# EAGLE design Photo-Penumograph (EAGLE 8.2.0)
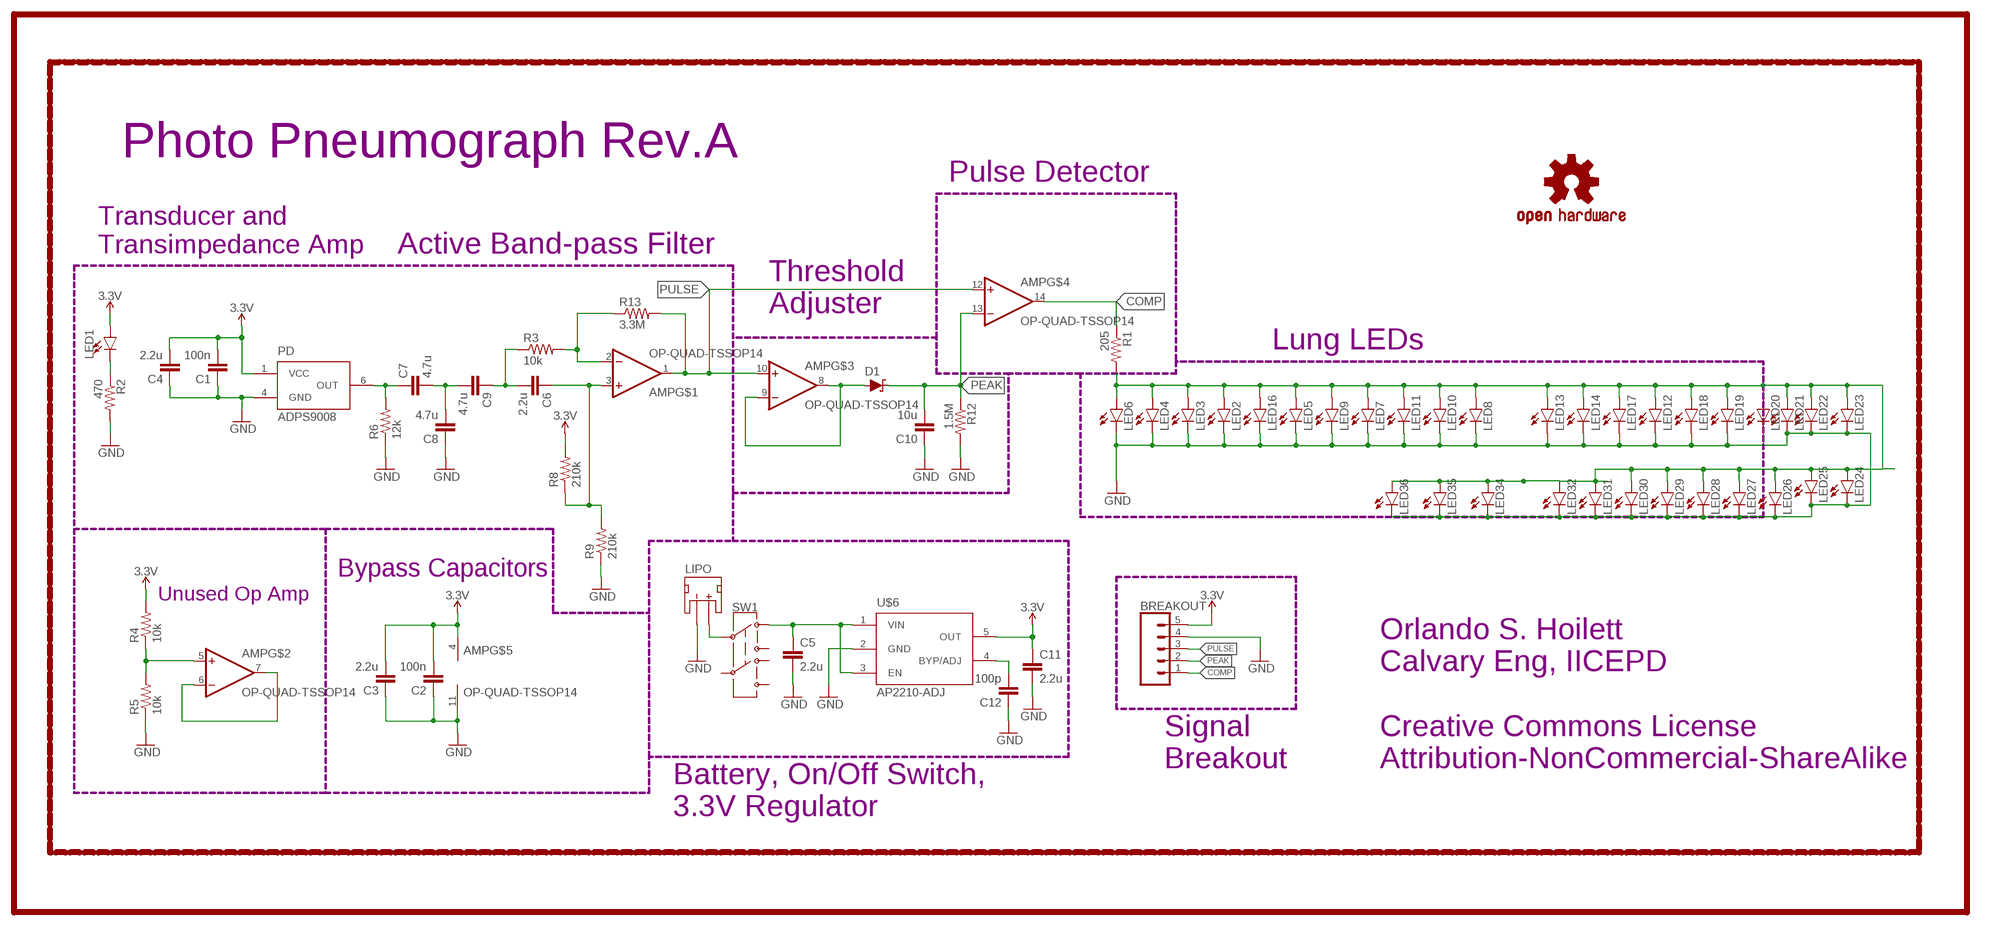
[diagram p0: schematic, sheet 1]

## Parts
AMP  OP-QUAD-TSSOP14  [TSSOP14]
BREAKOUT  CONN_05  [1X05]
C1  100n  CAPACITOR0402  [C0402]
C2  100n  CAPACITOR0402  [C0402]
C3  2.2u  CAPACITOR0603  [C0603]
C4  2.2u  CAPACITOR0603  [C0603]
C5  2.2u  CAPACITOR0603  [C0603]
C6  2.2u  CAPACITOR0603  [C0603]
C7  4.7u  CAPACITOR0603  [C0603]
C8  4.7u  CAPACITOR0603  [C0603]
C9  4.7u  CAPACITOR0603  [C0603]
C10  10u  CAPACITOR0805  [C0805]
C11  2.2u  CAPACITOR0603  [C0603]
C12  100p  CAPACITOR0402  [C0402]
D1  SCHOTTKY-SOD-123FL  [SOD123]
LED1  LEDZ-BEND  [2-SMD.Z-BEND]
LED2  LED5MM  [LED5MM]
LED3  LED5MM  [LED5MM]
LED4  LED5MM  [LED5MM]
LED5  LED5MM  [LED5MM]
LED6  LED5MM  [LED5MM]
LED7  LED5MM  [LED5MM]
LED8  LED5MM  [LED5MM]
LED9  LED5MM  [LED5MM]
LED10  LED5MM  [LED5MM]
LED11  LED5MM  [LED5MM]
LED12  LED5MM  [LED5MM]
LED13  LED5MM  [LED5MM]
LED14  LED5MM  [LED5MM]
LED16  LED5MM  [LED5MM]
LED17  LED5MM  [LED5MM]
LED18  LED5MM  [LED5MM]
LED19  LED5MM  [LED5MM]
LED20  LED5MM  [LED5MM]
LED21  LED5MM  [LED5MM]
LED22  LED5MM  [LED5MM]
LED23  LED5MM  [LED5MM]
LED24  LED5MM  [LED5MM]
LED25  LED5MM  [LED5MM]
LED26  LED5MM  [LED5MM]
LED27  LED5MM  [LED5MM]
LED28  LED5MM  [LED5MM]
LED29  LED5MM  [LED5MM]
LED30  LED5MM  [LED5MM]
LED31  LED5MM  [LED5MM]
LED32  LED5MM  [LED5MM]
LED34  LED5MM  [LED5MM]
LED35  LED5MM  [LED5MM]
LED36  LED5MM  [LED5MM]
LIPO  JST_2MM_MALE  [JST-2-SMD]
LOGO1  OSHW-LOGOS  [OSHW-LOGO-S]
PD  ADPS9008  [6-PIN.CHIPLED]
R1  205  RESISTOR0402  [R0402]
R2  470  RESISTOR0402  [R0402]
R3  10k  RESISTOR0402  [R0402]
R4  10k  RESISTOR0402  [R0402]
R5  10k  RESISTOR0402  [R0402]
R6  12k  RESISTOR0402  [R0402]
R8  210k  RESISTOR0402  [R0402]
R9  210k  RESISTOR0402  [R0402]
R12  1.5M  RESISTOR0402  [R0402]
R13  3.3M  RESISTOR0402  [R0402]
SW1  SWITCH.JS202011JCQN  [SWITCH.00]
U$6  AP2210-ADJ  [SOT23-5]

## Nets
3.3V: AMP.4(V+) BREAKOUT.5 C1.2 C2.2 C3.2 C4.2 C11.1 LED1.+(A) PD.1(VCC) R4.2 R8.2 U$6.5(OUT)
ANODE: LED2.A LED3.A LED4.A LED5.A LED6.A LED7.A LED8.A LED9.A LED10.A LED11.A LED12.A LED13.A LED14.A LED16.A LED17.A LED18.A LED19.A LED20.A LED21.A LED22.A LED23.A LED24.A LED25.A LED26.A LED27.A LED28.A LED29.A LED30.A LED32.A LED34.A LED35.A LED36.A R1.2
COMP: AMP.14(OUT) BREAKOUT.1 R1.1
GND: AMP.11(V-) BREAKOUT.4 C1.1 C2.1 C3.1 C4.1 C5.2 C8.1 C10.1 C11.2 C12.1 LED2.K(C) LED3.K(C) LED4.K(C) LED5.K(C) LED6.K(C) LED7.K(C) LED8.K(C) LED9.K(C) LED10.K(C) LED11.K(C) LED12.K(C) LED13.K(C) LED14.K(C) LED16.K(C) LED17.K(C) LED18.K(C) LED19.K(C) LED20.K(C) LED21.K(C) LED22.K(C) LED23.K(C) LED24.K(C) LED25.K(C) LED26.K(C) LED27.K(C) LED28.K(C) LED29.K(C) LED30.K(C) LED31.K(C) LED32.K(C) LED34.K(C) LED35.K(C) LED36.K(C) LIPO.1(-) PD.4(GND) R2.2 R5.1 R6.1 R9.1 R12.2 U$6.2(GND)
N$1: AMP.5(+IN) R4.1 R5.2
N$2: AMP.6(-IN) AMP.7(OUT)
N$3: C12.2 U$6.4(BYP/ADJ)
N$4: LIPO.2(+) SW1.2
N$5: C5.1 SW1.1 U$6.1(VIN) U$6.3(EN)
N$9: LED1.-(C) R2.1
N$10: AMP.8(OUT) AMP.9(-IN) D1.ANODE(A)
N$13: C7.2 C8.2 C9.2
N$14: C6.2 C9.1 R3.1
N$15: AMP.2(-IN) R3.2 R13.1
N$17: AMP.3(+IN) C6.1 R8.1 R9.2
N$18: C7.1 PD.6(OUT) R6.2
PEAK: AMP.13(-IN) BREAKOUT.2 C10.2 D1.CATH(C) R12.1
PULSE: AMP.1(OUT) AMP.10(+IN) AMP.12(+IN) BREAKOUT.3 R13.2
Unconnected: LED31.A LIPO.NC1(PAD1) LIPO.NC2(PAD2) SW1.3 SW1.5 SW1.6 SW1.7

## Notes on the sheet
- Photo Pneumograph Rev.A
- Pulse Detector
- Transducer and
  Transimpedance Amp
- Active Band-pass Filter
- Threshold
  Adjuster
- Lung LEDs
- Bypass Capacitors
- Unused Op Amp
- Signal
  Breakout
- Orlando S. Hoilett
  Calvary Eng, IICEPD
  
  Creative Commons License
  Attribution-NonCommercial-ShareAlike
- Battery, On/Off Switch,
  3.3V Regulator

## Library data of the parts
AMP = CalvEngIO-AnalogIC:OP-QUAD: General symbol and footprints for Quad Op Amps. Use with any standard general purpose op amp.
BREAKOUT = CalvEngIO-Connectors:CONN_05: Multi connection point. Often used as Generic Header-pin footprint for 0.1 inch spaced/style header connections On any of the 0.1 inch spaced packages, you can populate with these: Break Away Headers - Straight <https://www.sparkfun.com/products/116> (PRT-00116) Break Away Male Headers - Right Angle <https://www.sparkfun.com/products/553> (PRT-00553) Female Headers <https://www.sparkfun.com/products/115> (PRT-00115) Break Away Headers - Machine Pin <https://www.sparkfun.com/products/117> (PRT-00117) Break Away Female Headers - Swiss Machine Pin <https://www.sparkfun.com/products/743> (PRT-00743) For SCREWTERMINALS and SPRING TERMINALS visit here: Screw Terimnals on SparkFun.com <https://www.sparkfun.com/search/results?term=Screw+Terminals> (5mm/3.5mm/2.54mm spacing) This device is also useful as a general connection point to wire up your design to another part of your project. Our various solder wires solder well into these plated through hole pads. Hook-Up Wire - Assortment (Stranded, 22 AWG) <https://www.sparkfun.com/products/11375> (PRT-11375) Hook-Up Wire - Assortment (Solid Core, 22 AWG) <https://www.sparkfun.com/products/11367> (PRT-11367) View the entire wire category on our website here <https://www.sparkfun.com/categories/141> Special notes: Molex polarized connector foot print use with SKU : PRT-08231 with associated crimp pins and housings. 1MM SMD Version SKU: PRT-10208
C1-C12 = CalvEngIO-Passives:CAPACITOR
D1 = CalvEngIO-DiscreteSemi:SCHOTTKY: Schottky diode A Schottky diode is a semiconductor diode which has a low forward voltage drop and a very fast switching action. Example: Digi-Key Part Number: RB161MM-20CT-ND
LED1 = CalvEngIO-LED:LED: LED (Generic) Standard schematic elements and footprints for 5mm, 3mm, 1206, and 0603 sized LEDs. Generic LEDs with no color specified. LTST-C190KGKT: arrow indicates cathode
LED2-LED14 LED16-LED32 LED34-LED36 = SparkFun-LED:LED: LEDs Standard schematic elements and footprints for 5mm, 3mm, 1206, and 0603 sized LEDs. 5mm - Spark Fun Electronics SKU : COM-00529 (and others)
LIPO = CalvEngIO-Connectors:JST_2MM_MALE: JST 2MM MALE RA CONNECTOR Two pin, compact surface mount connector. Commonly used as a battery input connection point. We really like the solid locking feeling and high current rating on these small connectors. We use these all the time as battery connectors. Mates to single-cell LiPo batteries. Here is the connector we sell at SparkFun: JST Right Angle Connector - White <https://www.sparkfun.com/products/8612> (PRT-08612) Datasheet <http://www.sparkfun.com/datasheets/Prototyping/Connectors/JST-Horizontal.pdf> It was used on these SparkFun products: SparkFun MOSFET Power Controller <https://www.sparkfun.com/products/11214> (PRT-11214) SparkFun Battery Babysitter - LiPo Battery Manager <https://www.sparkfun.com/products/13777> (PRT-13777) And many, many others that required a lipo battery connection.; PROD_ID: CONN-11443; SF_ID: PRT-08612
LOGO1 = SparkFun-Aesthetics:OSHW-LOGO: Open Source Hardware Logo This logo indicates the piece of hardware it is found on incorporates a OSHW license and/or adheres to the definition of open source hardware found here: http://freedomdefined.org/OSHW
PD = CalvEngIO-Sensors:ADPS9008
R1-R6 R8 R9 R12 R13 = CalvEngIO-Passives:RESISTOR
SW1 = CalvEngIO-Switches:SWITCH.JS202011JCQN
U$6 = CalvEngIO-Power:AP2210-ADJ

## Board
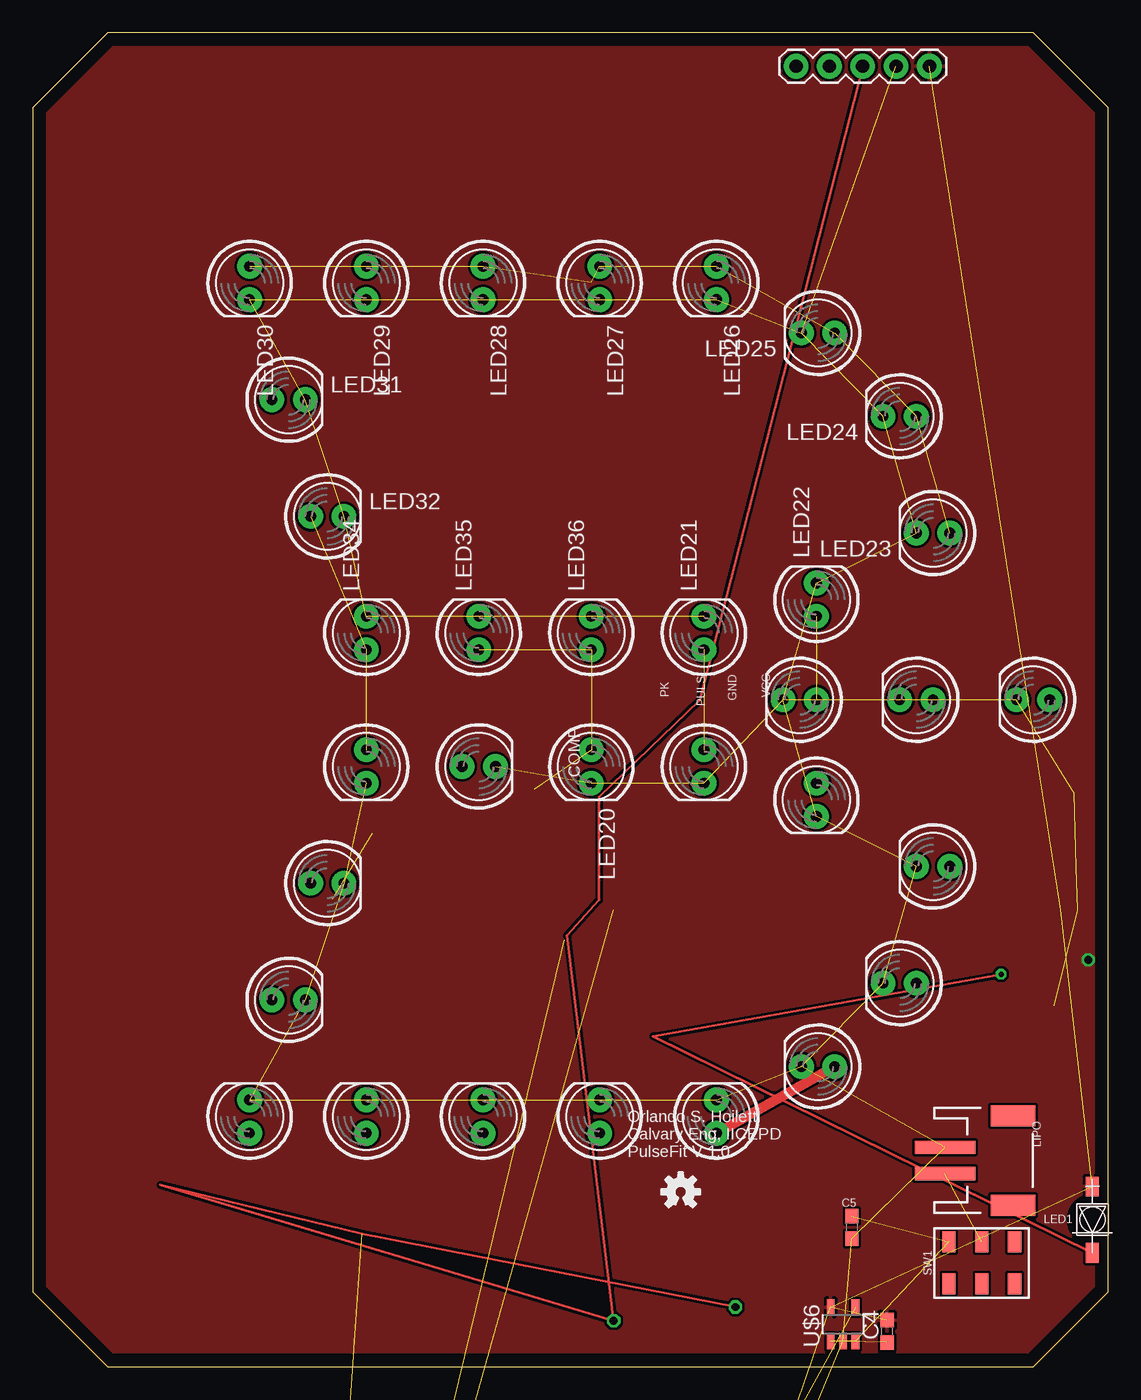
[diagram p1: board, top side]
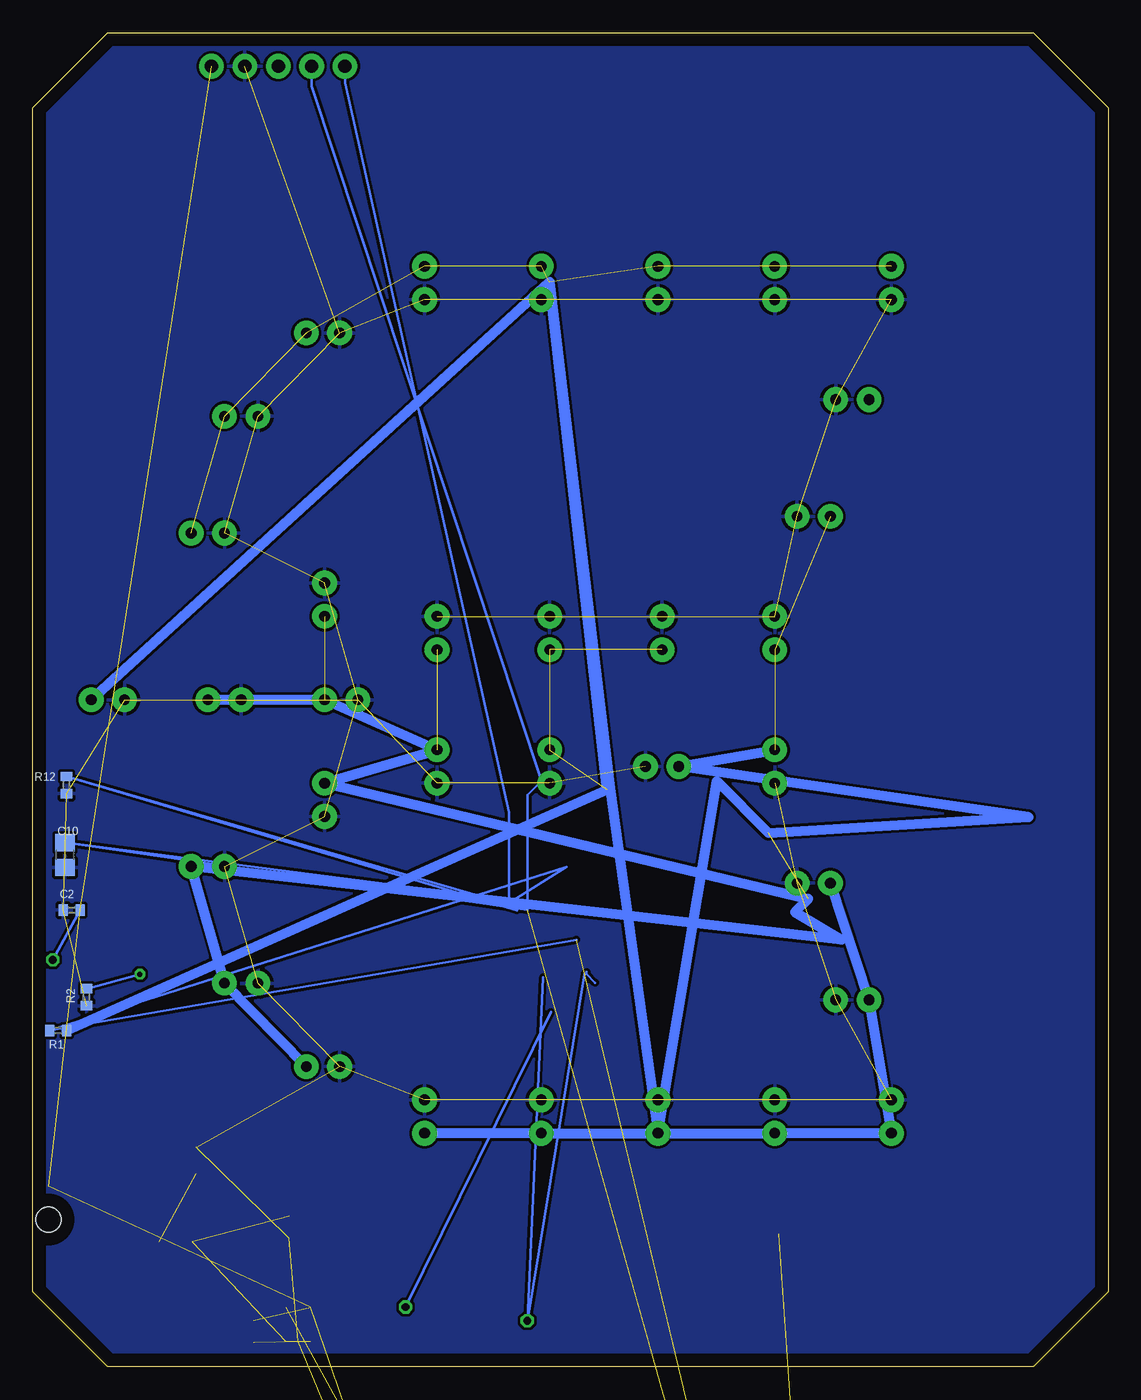
[diagram p2: board, bottom side, seen from below]

Size 81.92 x 101.6 mm. Coordinates in mm from the lower left corner, seen from the top.
Outline: 5.71,0 76.2,0 81.92,5.71 81.92,95.89 76.2,101.6 5.71,101.6 0,95.89 0,5.71 5.71,0
Copper layers (1*16): Top 0.035mm / dielectric 1.5mm / Bottom 0.035mm
Design rules "default": minimum track width 10mil, minimum drill 24mil, track to track 8mil, track to pad 8mil, pad to pad 8mil, via to via 8mil, smd to smd 8mil, copper to edge 40mil, drill to drill 8mil, minimum pad ring 10mil, minimum via ring 8mil, stop-mask expansion 4mil, vias tented up to drill 0mil, thermal gap 10mil

### Footprints (pad centres in the part's own frame; a part is rotated, then mirrored left to right if it is on the bottom)
TSSOP14 = smd 0.305 x 0.991: 1 -1.905,-2.718; 2 -1.27,-2.718; 3 -0.635,-2.718; 4 0,-2.718; 5 0.635,-2.718; 6 1.27,-2.718; 7 1.905,-2.718; 8 1.905,2.718; 9 1.27,2.718; 10 0.635,2.718; 11 0,2.718; 12 -0.635,2.718; 13 -1.27,2.718; 14 -1.905,2.718
1X05 = drill 1.016 pad 1.88: 1 0,0; 2 2.54,0; 3 5.08,0; 4 7.62,0; 5 10.16,0
C0402 = smd 0.7 x 0.9: 1 -0.65,0; 2 0.65,0
C0603 = smd 1.1 x 1: 1 -0.85,0; 2 0.85,0
C0805 = smd 1.3 x 1.5: 1 -0.95,0; 2 0.95,0
SOD123 = smd 1.2 x 0.85: ANODE 0,-1.525; CATH 0,1.525
2-SMD.Z-BEND = smd 1.5 x 1: + -2.525,0; - 2.525,0 | hole 1.9: 0,0
LED5MM = drill 0.813 pad 1.88: A -1.27,0; K 1.27,0
JST-2-SMD = smd 1 x 4.6: 1 -1,-3.7; 2 1,-3.7 | smd 1.6 x 3.4: NC1 -3.4,1.5; NC2 3.4,1.5
6-PIN.CHIPLED = smd 0.4 x 0.4: 1 0.6,0.65; 3 -0.6,0.65; 4 -0.6,-0.65; 6 0.6,-0.65 | smd 0.2 x 0.4: 2 0,0.65; 5 0,-0.65
R0402 = smd 0.7 x 0.9: 1 -0.65,0; 2 0.65,0
SWITCH.00 = smd 1 x 1.6: 1 -2.5,1.6; 2 0,1.6; 3 2.5,1.6; 5 -2.5,-1.6; 6 0,-1.6; 7 2.5,-1.6
SOT23-5 = smd 0.6 x 1.2: 1 -0.95,-1.306; 2 0,-1.306; 3 0.95,-1.306; 4 0.95,1.306; 5 -0.95,1.306

### Placement (x,y rotation side)
AMP  16.61,-78 0 top  (outside the outline)
BREAKOUT  58.14,99.06 0 top
C1  43.43,-43.66 0 top  (outside the outline)
C2  78.94,34.77 0 bottom
C3  9.98,-91.49 0 top  (outside the outline)
C4  65.07,2.69 90 top
C5  62.38,10.62 270 top
C6  33.93,-43.66 0 top  (outside the outline)
C7  45.11,-27.81 0 top  (outside the outline)
C8  21.89,-43.66 0 top  (outside the outline)
C9  27.91,-43.66 0 top  (outside the outline)
C10  79.48,38.96 90 bottom
C11  2.95,-100.99 0 top  (outside the outline)
C12  1.42,-105.74 0 top  (outside the outline)
D1  15.39,-69.42 0 top  (outside the outline)
LED1  80.72,11.2 270 top
LED2  67.31,50.8 180 top
LED3  58.42,50.8 180 top
LED4  51.12,45.72 270 top
LED5  59.69,43.18 270 top
LED6  68.58,38.1 180 top
LED7  66.04,29.21 180 top
LED8  59.82,22.86 180 top
LED9  52.07,19.05 90 top
LED10  43.18,19.05 90 top
LED11  25.4,19.05 90 top
LED12  16.51,19.05 90 top
LED13  19.48,27.94 0 top
LED14  22.43,36.83 0 top
LED16  25.4,45.72 270 top
LED17  33.97,45.72 0 top
LED18  34.29,19.05 90 top
LED19  76.2,50.8 180 top
LED20  42.55,45.72 270 top
LED21  51.12,55.88 90 top
LED22  59.69,58.42 90 top
LED23  68.58,63.5 180 top
LED24  66.04,72.39 180 top
LED25  59.82,78.74 180 top
LED26  52.07,82.55 270 top
LED27  43.18,82.55 270 top
LED28  34.29,82.55 270 top
LED29  25.4,82.55 270 top
LED30  16.51,82.55 270 top
LED31  19.48,73.66 0 top
LED32  22.43,64.77 0 top
LED34  25.4,55.88 90 top
LED35  33.97,55.88 90 top
LED36  42.55,55.88 90 top
LIPO  73.18,15.7 270 top
LOGO1  49.35,13.31 0 top
PD  20.83,-52.7 0 top  (outside the outline)
R1  79.98,25.6 0 bottom
R2  77.83,28.14 270 bottom
R3  35.1,-48.41 0 top  (outside the outline)
R4  20.35,-61.9 0 top  (outside the outline)
R5  20.35,-57.15 0 top  (outside the outline)
R6  39.4,-48.41 0 top  (outside the outline)
R8  25.35,-48.41 0 top  (outside the outline)
R9  30.23,-48.41 0 top  (outside the outline)
R12  79.35,44.3 270 bottom
R13  20.35,-48.41 0 top  (outside the outline)
SW1  72.29,7.9 0 top
U$6  61.72,3.23 0 top

### Tracks (layer width: path | path; a pad name or v marks a point on that pad's centre or on a via)
3.3V  (via drill 0.6)  (11 unrouted)
  Bottom 0.203: v80.39,30.99 C2.2
  pour Top: -5.82,106.17 132.99,103.63 128.45,-8.81 -8.33,-9.83
ANODE  (16 unrouted)
  Top 0.762: LED9.A LED8.A
  Bottom 0.762: LED19.A 42.55,82.62 | 42.55,82.62 37.95,44.04 LED18.A 29.82,44.6 25.88,40.66 6.07,41.86 LED17.A LED16.A | LED14.A LED13.A LED12.A LED11.A LED10.A LED9.A | LED8.A LED7.A LED6.A 20.3,32.51 23.85,34.62 22.84,35.64 LED5.A LED4.A LED3.A LED2.A | R1.2 38.19,43.96 42.55,82.62
COMP  (1 unrouted)
  Bottom 0.203: 40.5,32.51 R1.1 41.27,38.05 45.64,35.31 45.64,42.22 58.14,97.79 BREAKOUT.1
GND  (51 unrouted)
  pour Bottom: 138.91,105.82 134.09,-6.45 -11.76,-6.86 -10.24,110.24
N$1  (2 unrouted)
N$2  (1 unrouted)
N$3  (1 unrouted)
N$4  (1 unrouted)
N$5  (3 unrouted)
N$9  (via drill 0.38)
  Top 0.203: LED1.- 47.24,25.17 v73.76,29.9
  Bottom 0.203: v73.76,29.9 R2.1
N$10  (2 unrouted)
N$13  (2 unrouted)
N$14  (2 unrouted)
N$15  (2 unrouted)
N$17  (3 unrouted)
N$18  (2 unrouted)
PEAK  (2 unrouted)
  Bottom 0.203: 45.03,34.76 R12.1 44.25,34.79 | BREAKOUT.2 60.69,97.53 43.16,44.62 44.25,43.54 44.25,34.79 | 43.19,35.26 C10.2 44.25,34.79
PULSE  (via drill 0.6)  (4 unrouted)
  Top 0.203: v53.52,4.55 25.09,10.13 9.7,13.84 v44.25,3.5 40.69,32.84 43.13,35.53 43.13,43.38 50.8,50.8 63.25,99.03 BREAKOUT.3
  Bottom 0.203: 39.08,29.25 39.75,29.92 39.88,29.92 | 39.88,29.92 v44.25,3.5 43.04,29.67 | 39.73,30.07 39.88,29.92 | 42.45,27.01 v53.52,4.55

### Text on the board
_tsilk: PK | GND | VCC | PULS | COMP | Orlando S. Hoilett / Calvary Eng, IICEPD / PulseFit V.1.0